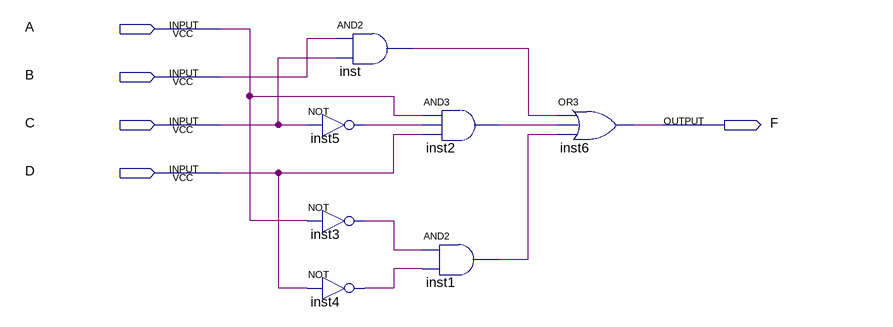
[diagram p0: schematic sheet]
// Quartus schematic part2_neat.bdf as structural Verilog: 7 symbols, 5 pins
module part2_neat (
  input  A,
  input  B,
  input  C,
  input  D,
  output F
);

  wire inst1_out, inst2_out, inst3_out, inst4_out, inst5_out, inst_out;

  and inst (inst_out, B, C);
  not inst5 (inst5_out, C);
  not inst3 (inst3_out, A);
  not inst4 (inst4_out, D);
  and inst2 (inst2_out, A, inst5_out, D);
  and inst1 (inst1_out, inst3_out, inst4_out);
  or inst6 (F, inst_out, inst2_out, inst1_out);
endmodule
